# EAGLE design DMX-A (EAGLE 6.4)
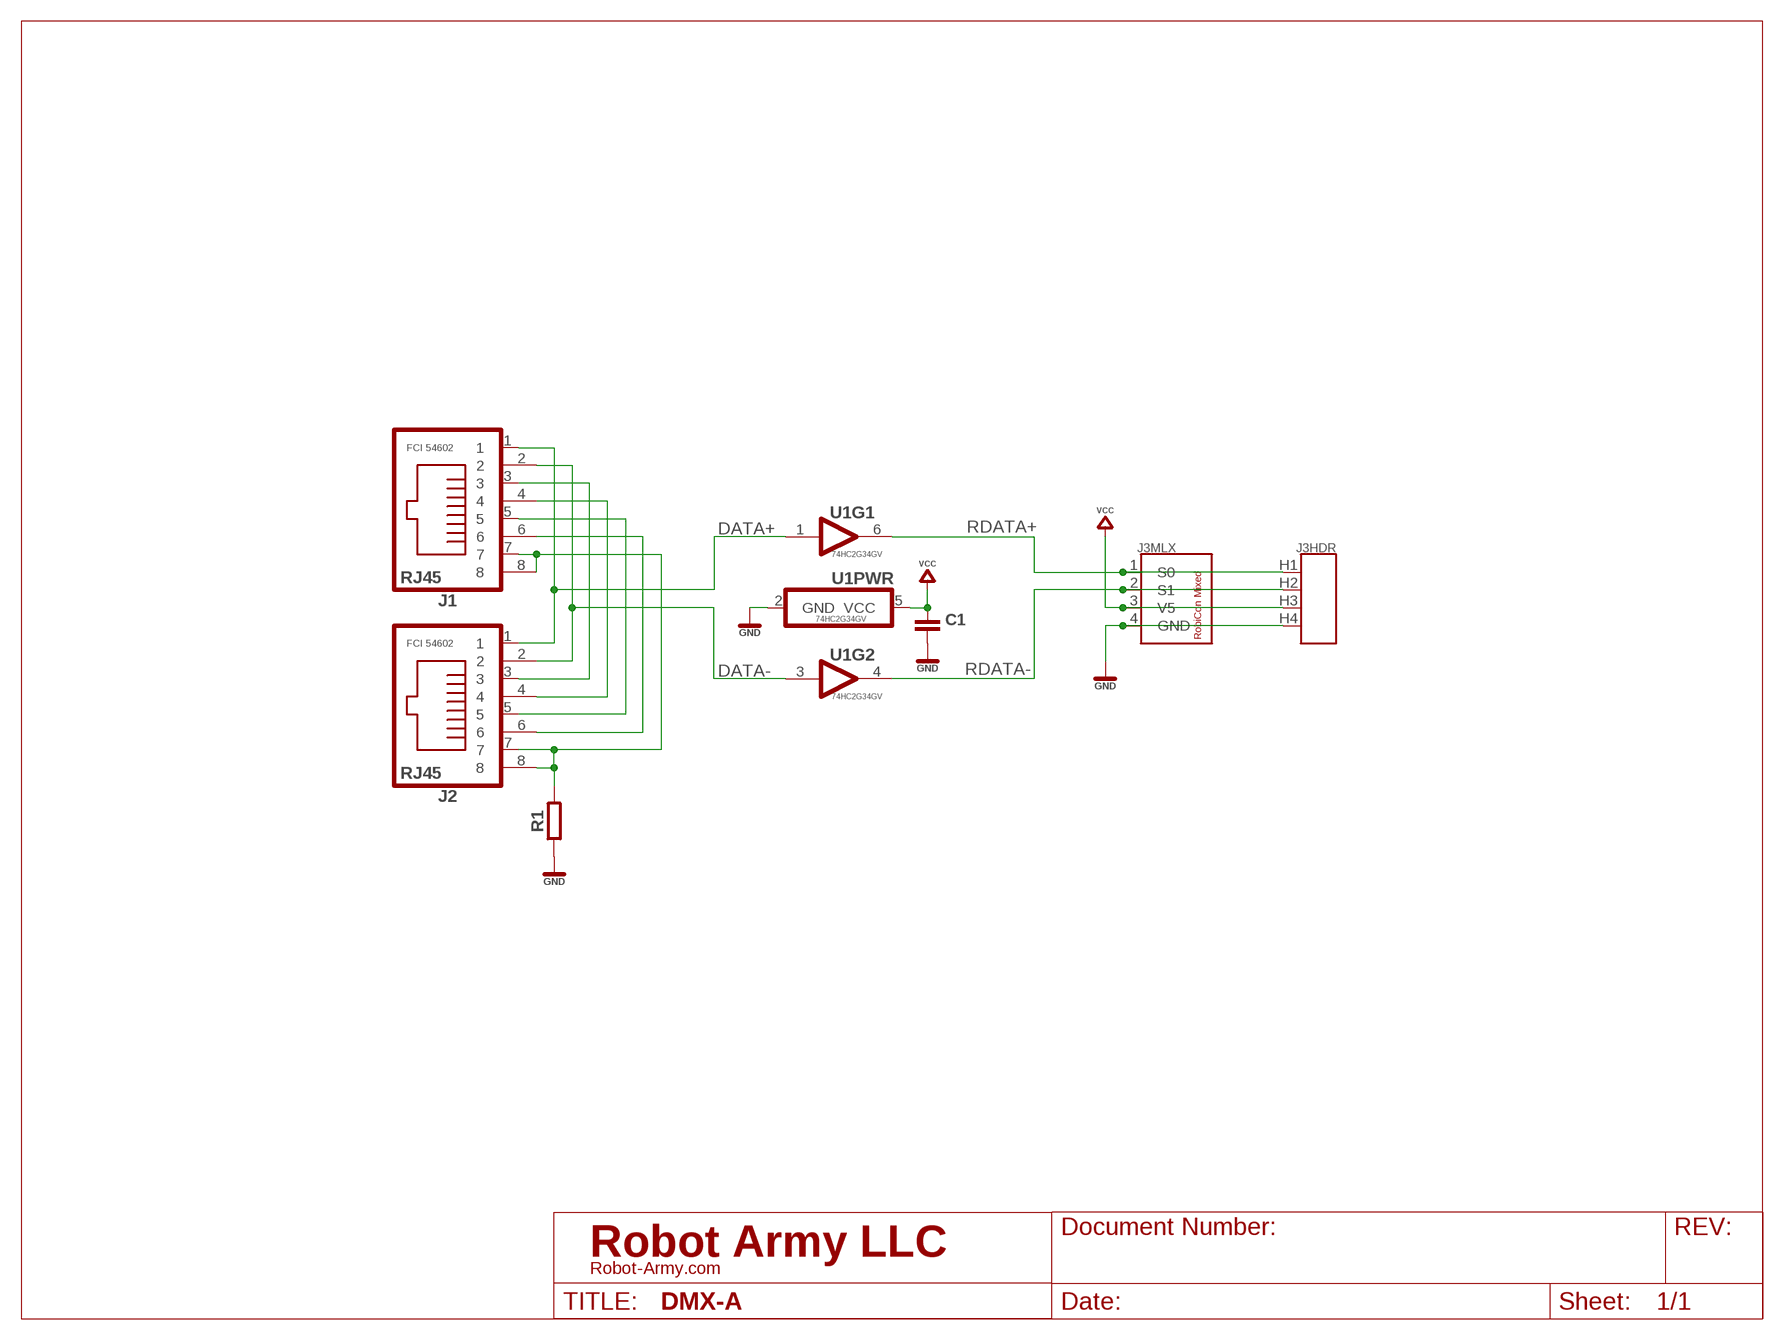
[diagram p0: schematic, sheet 1]
U$1 (LETTER_L-LIGHTPLAY): REV: A

## Parts
C1  CAPACITOR0603  [0603]
J1  FCI 54602  RJ45FCI_54602  [FCI_54602]
J2  FCI 54602  RJ45FCI_54602  [FCI_54602]
J3  ROBICON_M_04P_DUAL  [ROBICON-DUAL-04P]
R1  RESISTOR1206  [1206]
U1  74HC2G34GV  [TSOP-6]

## Nets
DATA+: J1.1 J2.1 U1.1(A)
DATA-: J1.2 J2.2 U1.3(A)
GND: C1.2 J3.4(MLX:GND) J3.H4 R1.1 U1.2(PWR:GND)
N$6: J1.3 J2.3
N$7: J1.4 J2.4
N$8: J1.5 J2.5
N$9: J1.6 J2.6
RDATA+: J3.1(MLX:S0) J3.H1 U1.6(Y)
RDATA-: J3.2(MLX:S1) J3.H2 U1.4(Y)
RJ_GND: J1.7 J1.8 J2.7 J2.8 R1.2
VCC: C1.1 J3.3(MLX:V5) J3.H3 U1.5(PWR:VCC)

## Library data of the parts
C1 = rlc:CAPACITOR: Capacitor CAP
J1 J2 = con-rj45:RJ45: RJ45 Unshielded
J3 = robicon-connectors-m:ROBICON_M_04P_DUAL
R1 = rlc:RESISTOR: Resistor
U1 = logic:74HC2G34: 74HC2G34 - Dual Driver

## Board
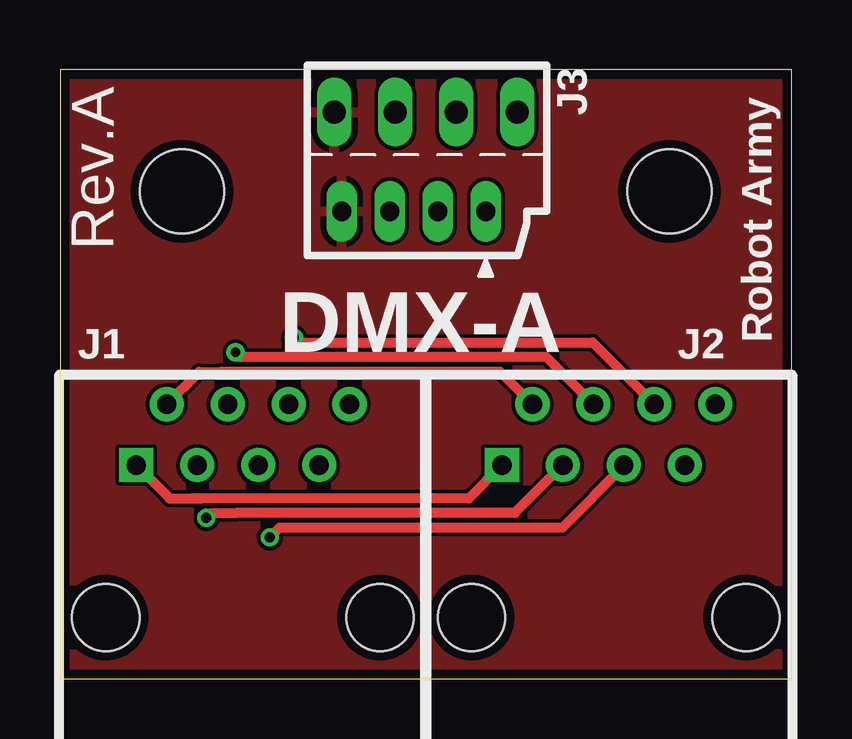
[diagram p1: board, top side]
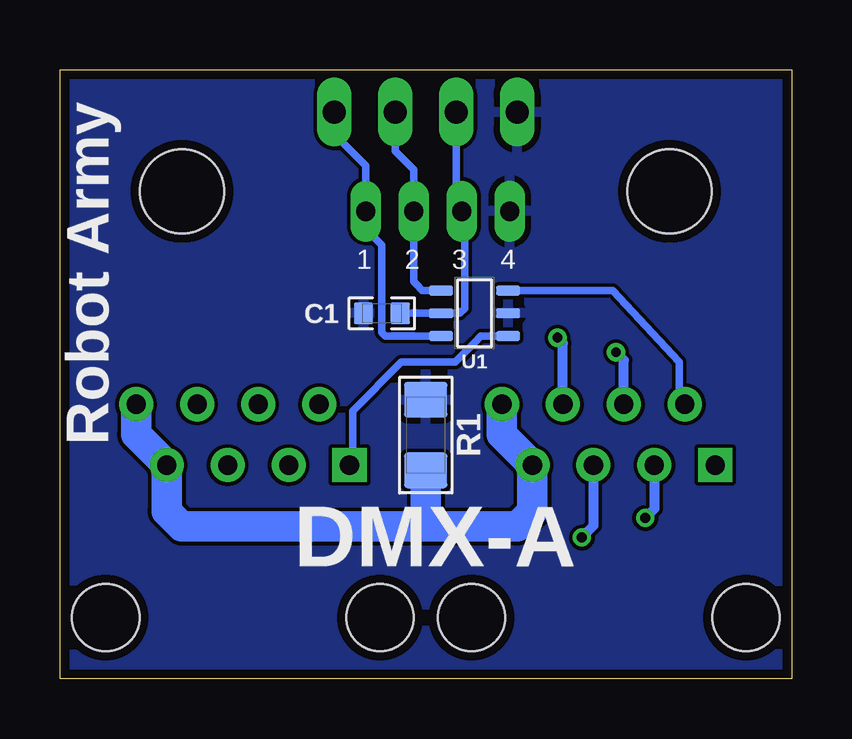
[diagram p2: board, bottom side, seen from below]

Size 30.48 x 25.4 mm. Coordinates in mm from the lower left corner, seen from the top.
Outline: 0,0 30.48,0 30.48,25.4 0,25.4 0,0
Copper layers (1*16): Top 0.0356mm / dielectric 1.5011mm / Bottom 0.0356mm
Design rules "OSH-CircuitMonkey *": minimum track width 6mil, minimum drill 13mil, track to track 6mil, track to pad 6mil, pad to pad 6mil, via to via 6mil, smd to smd 6mil, copper to edge 15mil, drill to drill 6mil, minimum pad ring 7mil, minimum via ring 7mil, stop-mask expansion 3mil, vias tented up to drill 16mil, thermal gap 10mil
Holes 3.51 mm at 5.08,20.32 25.4,20.32

### Footprints (pad centres in the part's own frame; a part is rotated, then mirrored left to right if it is on the bottom)
0603 = smd 0.8 x 0.9: 1 -0.763,0; 2 0.763,0
FCI_54602 = drill 0.8 pad 1.422 square: 1 -4.445,5.1 | drill 0.8 pad 1.422: 2 -3.175,7.64; 3 -1.905,5.1; 4 -0.635,7.64; 5 0.635,5.1; 6 1.905,7.64; 7 3.175,5.1; 8 4.445,7.64 | hole 2.8: -5.715,-1.25; 5.715,-1.25
ROBICON-DUAL-04P = drill 0.8 pad 1.27 long: 1 2.1,2.5; 2 2.1,0.5; 3 2.1,-1.5; 4 2.1,-3.5 | drill 0.965 pad 1.27 long: H1 -2.04,3.81; H2 -2.04,1.27; H3 -2.04,-1.27; H4 -2.04,-3.81
1206 = smd 1.5 x 1.803: 1 -1.472,0; 2 1.472,0
TSOP-6 = smd 0.4 x 1: 1 -0.95,-1.4; 2 0,-1.4; 3 0.95,-1.4; 4 0.95,1.4; 5 0,1.4; 6 -0.95,1.4

### Placement (x,y rotation side)
C1  17.07,15.24 180 bottom
J1  7.62,3.81 0 top
J2  22.86,3.81 0 top
J3  15.24,21.59 270 top
R1  15.24,10.16 270 bottom
U1  13.21,15.24 90 bottom

### Tracks (layer width: path | path; a pad name or v marks a point on that pad's centre or on a via)
DATA+
  Top 0.406: J2.1 17.02,7.52 5.89,7.52 | 5.89,7.52 5.49,7.52 | J1.1 4.57,7.52 5.89,7.52
  Bottom 0.305: J2.1 18.32,8.91 18.29,9.14 18.29,11.18 16.26,13.21 14.02,13.21 13.21,14.02 12.94,14.29 U1.1
DATA-
  Top 0.406: J2.2 18.33,12.8 6.71,12.8 5.8,12.8 J1.2
  Bottom 0.305: U1.3 7.45,16.19 4.67,13.21 4.67,11.68 J1.2
GND
  pour Top: 0,25.4 30.48,25.4 30.48,0 0,0
  pour Bottom: 0,25.4 30.48,25.4 30.48,0 0,0
N$6  (via drill 0.41)
  Top 0.406: J2.3 18.95,6.91 7.32,6.91 6.3,6.91 v6.1,6.71
  Bottom 0.406: J1.3 5.71,7.09 v6.1,6.71
N$7  (via drill 0.41)
  Top 0.406: J2.4 20.26,13.41 7.52,13.41 v7.32,13.61
  Bottom 0.406: J1.4 6.99,13.28 v7.32,13.61
N$8  (via drill 0.41)
  Top 0.406: J2.5 23.5,8.87 20.93,6.3 9.14,6.3 v8.74,5.89
  Bottom 0.406: J1.5 8.26,6.38 v8.74,5.89
N$9  (via drill 0.41)
  Top 0.406: v9.75,14.22 9.96,14.02 22.19,14.02 J2.6
  Bottom 0.406: J1.6 9.53,13.99 v9.75,14.22
RDATA+
  Bottom 0.305: U1.6 16.93,14.29 17.07,14.43 17.07,16.05 17.07,18.09 17.68,18.69 17.68,19.43 J3.1 17.74,21.4 17.88,21.54 19.05,22.71 J3.H1
RDATA-
  Bottom 0.305: U1.4 15.38,16.19 15.65,16.46 15.74,16.55 15.74,17.79 J3.2 15.74,21.23 15.85,21.34 16.51,22 J3.H2
RJ_GND
  Bottom 1.27: J2.8 27.3,10.18 J2.7 26.04,6.99 25.4,6.35 15.24,6.35 | 15.24,6.35 12.7,6.35 11.43,6.35 10.79,6.99 J1.7 12.06,10.18 J1.8 | R1.2 15.24,6.35
VCC
  Bottom 0.305: C1.1 U1.5 13.82,15.24 13.61,15.44 13.61,19.36 J3.3 13.97,19.72 J3.H3

### Text on the board
tPlace: Rev.A | DMX-A | Robot Army
bPlace: Robot Army | DMX-A